# Altium schematic sheet LED_DIPSWITCH.SchDoc: Board-On-Chip LEDs and DIP Switch
size A4; Organization: Altium Limited; Address1: L3, 12a Rodborough Rd; Address2: Frenchs Forest; Address3: NSW; Address4: Australia 2086; DocumentNumber: 5; Revision: 1.05; SheetNumber: 5; SheetTotal: 7
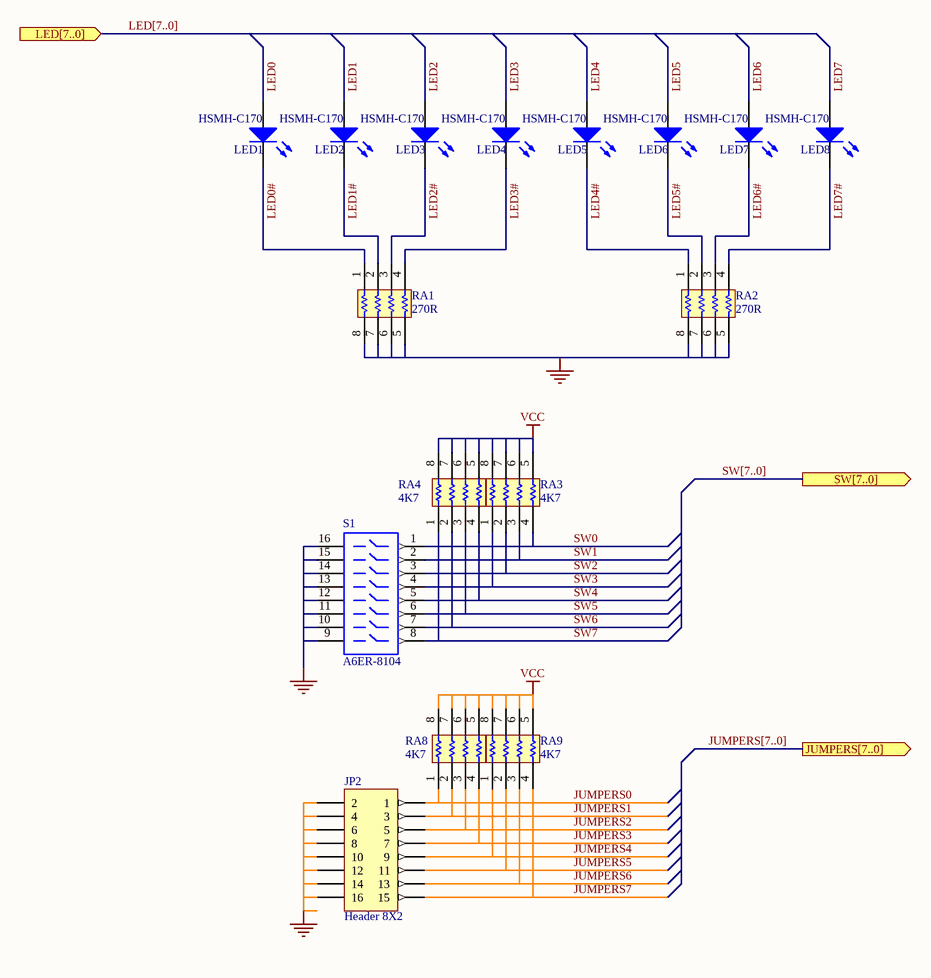
[diagram p0: LED_DIPSWITCH.SchDoc]

## Parts
JP2  Header 8X2  [HDR2X8]
LED1  HSMH-C170  [SMD _LED]
LED2  HSMH-C170  [SMD _LED]
LED3  HSMH-C170  [SMD _LED]
LED4  HSMH-C170  [SMD _LED]
LED5  HSMH-C170  [SMD _LED]
LED6  HSMH-C170  [SMD _LED]
LED7  HSMH-C170  [SMD _LED]
LED8  HSMH-C170  [SMD _LED]
RA1  270R  [MNR34]
RA2  270R  [MNR34]
RA3  4K7  [MNR34]
RA4  4K7  [MNR34]
RA8  4K7  [MNR34]
RA9  4K7  [MNR34]
S1  A6ER-8104  [DIP-16-KEY]

## Ports
JUMPERS[7..0] (out), LED[7..0] (in), SW[7..0] (out)

## Nets
GND: JP2.2 JP2.4 JP2.6 JP2.8 JP2.10 JP2.12 JP2.14 JP2.16 RA1.5 RA1.6 RA1.7 RA1.8 RA2.5 RA2.6 RA2.7 RA2.8 S1.9 S1.10 S1.11 S1.12 S1.13 S1.14 S1.15 S1.16
VCC: RA3.5 RA3.6 RA3.7 RA3.8 RA4.5 RA4.6 RA4.7 RA4.8 RA8.5 RA8.6 RA8.7 RA8.8 RA9.5 RA9.6 RA9.7 RA9.8
JUMPERS0: JP2.1 RA8.1
JUMPERS1: JP2.3 RA8.2
JUMPERS2: JP2.5 RA8.3
JUMPERS3: JP2.7 RA8.4
JUMPERS4: JP2.9 RA9.1
JUMPERS5: JP2.11 RA9.2
JUMPERS6: JP2.13 RA9.3
JUMPERS7: JP2.15 RA9.4
LED0: LED1.1(A)
LED0#: LED1.2(K) RA1.1
LED1: LED2.1(A)
LED1#: LED2.2(K) RA1.2
LED2: LED3.1(A)
LED2#: LED3.2(K) RA1.3
LED3: LED4.1(A)
LED3#: LED4.2(K) RA1.4
LED4: LED5.1(A)
LED4#: LED5.2(K) RA2.1
LED5: LED6.1(A)
LED5#: LED6.2(K) RA2.2
LED6: LED7.1(A)
LED6#: LED7.2(K) RA2.3
LED7: LED8.1(A)
LED7#: LED8.2(K) RA2.4
SW0: RA3.4 S1.1
SW1: RA3.3 S1.2
SW2: RA3.2 S1.3
SW3: RA3.1 S1.4
SW4: RA4.4 S1.5
SW5: RA4.3 S1.6
SW6: RA4.2 S1.7
SW7: RA4.1 S1.8

## Buses and harness runs
bus JUMPERS[7..0] = port JUMPERS[7..0]
bus LED[7..0] = port LED[7..0]
bus SW[7..0] = port SW[7..0]

## Notes on the sheet
- Title
- Size:
- Date:
- A
- Number:
- Time:
- Revision:
- Sheet
- of
- File:

## Library data of the parts
JP2 = Header 8X2: Header, 8-Pin, Dual row; Manufacturer: Generic Components; Class I: Connector; Revision: July-2002: Re-released for DXP Platform.; Publisher: Altium Limited
LED1-LED8 = HSMX-C670: Typical RED GaAs SMD LED Agilent make; Manufacturer: Generic Components; Class I: Optoelectronic; Fitted: True; Published: 8-Jun-2000; Revision: July-2002: Re-released for DXP Platform.; Publisher: Altium Limited; Class II: LED
RA1-RA4 RA8 RA9 = MNR34: 3216x4 Resistor Array; Fitted: True
S1 = A6ER-8104: DIP Switch Side actuator long liver Piano Key; Manufacturer: Generic Components; Fitted: True; Published: 24-Mar-1999; Revision: July-2002: Re-released for DXP Platform.; Publisher: Altium Limited